# EAGLE schematic MCU (EAGLE 9.1.3)
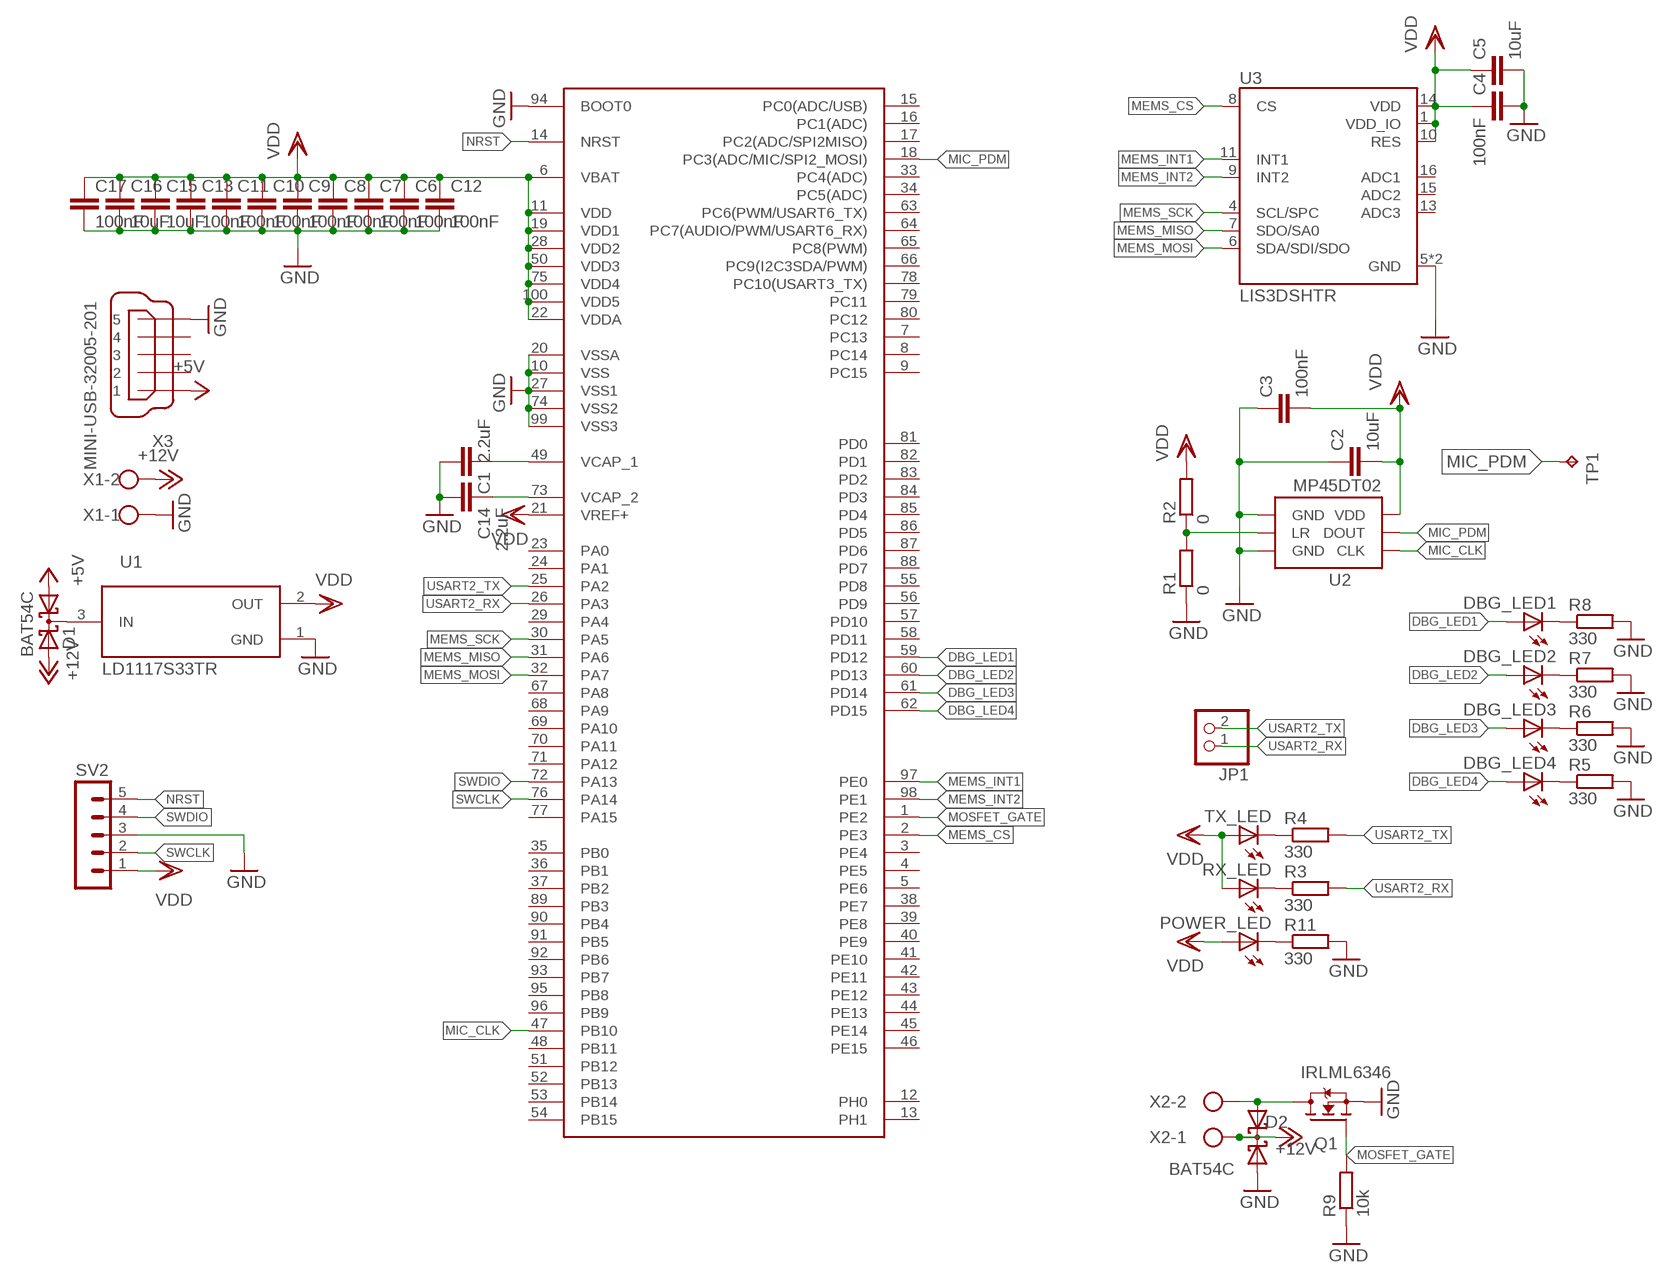
[diagram p0: schematic, sheet 1]

## Parts
C1  2.2uF  C-EUC0603  [C0603]
C2  10uF  C-EUC0805  [C0805]
C3  100nF  C-EUC0603  [C0603]
C4  100nF  C-EUC0603  [C0603]
C5  10uF  C-EUC0805  [C0805]
C6  100nF  C-EUC0603  [C0603]
C7  100nF  C-EUC0603  [C0603]
C8  100nF  C-EUC0603  [C0603]
C9  100nF  C-EUC0603  [C0603]
C10  100nF  C-EUC0603  [C0603]
C11  100nF  C-EUC0603  [C0603]
C12  100nF  C-EUC0603  [C0603]
C13  100nF  C-EUC0603  [C0603]
C14  2.2uF  C-EUC0603  [C0603]
C15  10uF  C-EUC0805  [C0805]
C16  10uF  C-EUC0805  [C0805]
C17  100nF  C-EUC0603  [C0603]
D1  BAT54C  [SOT23]
D2  BAT54C  [SOT23]
DBG_LED1  LEDCHIP-LED0603  [CHIP-LED0603]
DBG_LED2  LEDCHIP-LED0603  [CHIP-LED0603]
DBG_LED3  LEDCHIP-LED0603  [CHIP-LED0603]
DBG_LED4  LEDCHIP-LED0603  [CHIP-LED0603]
JP1  PINHD-1X2  [1X02]
POWER_LED  LEDCHIP-LED0603  [CHIP-LED0603]
Q1  IRLML6346  [SOT23]
R1  0  R-EU_R0603  [R0603]
R2  0  R-EU_R0603  [R0603]
R3  330  R-EU_R0603  [R0603]
R4  330  R-EU_R0603  [R0603]
R5  330  R-EU_R0603  [R0603]
R6  330  R-EU_R0603  [R0603]
R7  330  R-EU_R0603  [R0603]
R8  330  R-EU_R0603  [R0603]
R9  10k  R-EU_R0603  [R0603]
R11  330  R-EU_R0603  [R0603]
RX_LED  LEDCHIP-LED0603  [CHIP-LED0603]
SV2  MA05-1  [MA05-1]
TP1  TPB1,27  [B1,27]
TX_LED  LEDCHIP-LED0603  [CHIP-LED0603]
U1  LD1117S33TR  [SOT230P700X180-4N]
U2  MP45DT02  [ST_HLGA6]
U3  LIS3DSHTR  [LGA16R50P5X3_300X300X100N]
U$1  STM32F407STM32D40X  [LQFP100]
X1  W237-102  [W237-102]
X2  W237-102  [W237-102]
X3  MINI-USB-32005-201  [32005-201]

## Nets
+5V: D1.1(A1) X3.1
+12V: D1.2(A2) D2.3(CC) X1.2 X2.1
DBG_LED1: DBG_LED1.A U$1.59(PD12)
DBG_LED2: DBG_LED2.A U$1.60(PD13)
DBG_LED3: DBG_LED3.A U$1.61(PD14)
DBG_LED4: DBG_LED4.A U$1.62(PD15)
GND: C1.2 C2.1 C3.1 C4.2 C5.2 C6.2 C7.2 C8.2 C9.2 C10.2 C11.2 C12.2 C13.2 C14.2 C15.2 C16.2 C17.2 D2.1(A1) Q1.2(S) R1.1 R5.2 R6.2 R7.2 R8.2 R9.1 R11.2 SV2.3 U1.1(GND) U2.1(GND) U2.3(GND) U3.5(GND) U3.12(GND) U$1.10(VSS) U$1.20(VSSA) U$1.27(VSS1) U$1.74(VSS2) U$1.94(BOOT0) U$1.99(VSS3) X1.1 X3.5
MEMS_CS: U3.8(CS) U$1.2(PE3)
MEMS_INT1: U3.11(INT1) U$1.97(PE0)
MEMS_INT2: U3.9(INT2) U$1.98(PE1)
MEMS_MISO: U3.7(SDO/SA0) U$1.31(PA6)
MEMS_MOSI: U3.6(SDA/SDI/SDO) U$1.32(PA7)
MEMS_SCK: U3.4(SCL/SPC) U$1.30(PA5)
MIC_CLK: U2.4(CLK) U$1.47(PB10)
MIC_PDM: TP1.TP U2.5(DOUT) U$1.18(PC3(ADC/MIC/SPI2_MOSI))
MOSFET_GATE: Q1.1(G) R9.2 U$1.1(PE2)
N$1: POWER_LED.C R11.1
N$2: C14.1 U$1.73(VCAP_2)
N$3: R1.2 R2.1 U2.2(LR)
N$4: R3.1 RX_LED.C
N$5: C1.1 U$1.49(VCAP_1)
N$6: D1.3(CC) U1.3(IN)
N$7: R4.1 TX_LED.C
N$9: DBG_LED4.C R5.1
N$10: DBG_LED3.C R6.1
N$11: DBG_LED2.C R7.1
N$12: DBG_LED1.C R8.1
N$13: D2.2(A2) Q1.3(D) X2.2
NRST: SV2.5 U$1.14(NRST)
SWCLK: SV2.2 U$1.76(PA14)
SWDIO: SV2.4 U$1.72(PA13)
USART2_RX: JP1.1 R3.2 U$1.26(PA3)
USART2_TX: JP1.2 R4.2 U$1.25(PA2)
VDD: C2.2 C3.2 C4.1 C5.1 C6.1 C7.1 C8.1 C9.1 C10.1 C11.1 C12.1 C13.1 C15.1 C16.1 C17.1 POWER_LED.A R2.2 RX_LED.A SV2.1 TX_LED.A U1.2(OUT) U2.6(VDD) U3.1(VDD_IO) U3.10(RES) U3.14(VDD) U$1.6(VBAT) U$1.11(VDD) U$1.19(VDD1) U$1.21(VREF+) U$1.22(VDDA) U$1.28(VDD2) U$1.50(VDD3) U$1.75(VDD4) U$1.100(VDD5)
Unconnected: U3.13(ADC3) U3.15(ADC2) U3.16(ADC1) U$1.3(PE4) U$1.4(PE5) U$1.5(PE6) U$1.7(PC13) U$1.8(PC14) U$1.9(PC15) U$1.12(PH0) U$1.13(PH1) U$1.15(PC0(ADC/USB)) U$1.16(PC1(ADC)) U$1.17(PC2(ADC/SPI2MISO)) U$1.23(PA0) U$1.24(PA1) U$1.29(PA4) U$1.33(PC4(ADC)) U$1.34(PC5(ADC)) U$1.35(PB0) U$1.36(PB1) U$1.37(PB2) U$1.38(PE7) U$1.39(PE8) U$1.40(PE9) U$1.41(PE10) U$1.42(PE11) U$1.43(PE12) U$1.44(PE13) U$1.45(PE14) U$1.46(PE15) U$1.48(PB11) U$1.51(PB12) U$1.52(PB13) U$1.53(PB14) U$1.54(PB15) U$1.55(PD8) U$1.56(PD9) U$1.57(PD10) U$1.58(PD11) U$1.63(PC6(PWM/USART6_TX)) U$1.64(PC7(AUDIO/PWM/USART6_RX)) U$1.65(PC8(PWM)) U$1.66(PC9(I2C3SDA/PWM)) U$1.67(PA8) U$1.68(PA9) U$1.69(PA10) U$1.70(PA11) U$1.71(PA12) U$1.77(PA15) U$1.78(PC10(USART3_TX)) U$1.79(PC11) U$1.80(PC12) U$1.81(PD0) U$1.82(PD1) U$1.83(PD2) U$1.84(PD3) U$1.85(PD4) U$1.86(PD5) U$1.87(PD6) U$1.88(PD7) U$1.89(PB3) U$1.90(PB4) U$1.91(PB5) U$1.92(PB6) U$1.93(PB7) U$1.95(PB8) U$1.96(PB9) X3.2 X3.3 X3.4

## Library data of the parts
C1-C17 = resistor:C-EU: CAPACITOR, European symbol
D1 D2 = diode:BAT54C: Schottky Diodes Source: Fairchild .. BAT54.pdf
DBG_LED1-DBG_LED4 POWER_LED RX_LED TX_LED = led:LED: LED OSRAM: - CHIPLED LG R971, LG N971, LY N971, LG Q971, LY Q971, LO R971, LY R971 LH N974, LH R974 LS Q976, LO Q976, LY Q976 LO Q996 - Hyper CHIPLED LW Q18S LB Q993, LB Q99A, LB R99A - SideLED LS A670, LO A670, LY A670, LG A670, LP A670 LB A673, LV A673, LT A673, LW A673 LH A674 LY A675 LS A676, LA A676, LO A676, LY A676, LW A676 LS A679, LY A679, LG A679 - Hyper Micro SIDELED® LS Y876, LA Y876, LO Y876, LY Y876 LT Y87S - SmartLED LW L88C, LW L88S LB L89C, LB L89S, LG L890 LS L89K, LO L89K, LY L89K LS L896, LA L896, LO L896, LY L896 - TOPLED LS T670, LO T670, LY T670, LG T670, LP T670 LSG T670, LSP T670, LSY T670, LOP T670, LYG T670 LG T671, LOG T671, LSG T671 LB T673, LV T673, LT T673, LW T673 LH T674 LS T676, LA T676, LO T676, LY T676, LB T676, LH T676, LSB T676, LW T676 LB T67C, LV T67C, LT T67C, LS T67K, LO T67K, LY T67K, LW E67C LS E67B, LA E67B, LO E67B, LY E67B, LB E67C, LV E67C, LT E67C LW T67C LS T679, LY T679, LG T679 LS T770, LO T770, LY T770, LG T770, LP T770 LB T773, LV T773, LT T773, LW T773 LH T774 LS E675, LA E675, LY E675, LS T675 LS T776, LA T776, LO T776, LY T776, LB T776 LHGB T686 LT T68C, LB T68C - Hyper Mini TOPLED® LB M676 - Mini TOPLED Santana® LG M470 LS M47K, LO M47K, LY M47K Source: http://www.osram.convergy.de LUXEON: - LUMILED® LXK2-PW12-R00, LXK2-PW12-S00, LXK2-PW14-U00, LXK2-PW14-V00 LXK2-PM12-R00, LXK2-PM12-S00, LXK2-PM14-U00 LXK2-PE12-Q00, LXK2-PE12-R00, LXK2-PE12-S00, LXK2-PE14-T00, LXK2-PE14-U00 LXK2-PB12-K00, LXK2-PB12-L00, LXK2-PB12-M00, LXK2-PB14-N00, LXK2-PB14-P00, LXK2-PB14-Q00 LXK2-PR12-L00, LXK2-PR12-M00, LXK2-PR14-Q00, LXK2-PR14-R00 LXK2-PD12-Q00, LXK2-PD12-R00, LXK2-PD12-S00 LXK2-PH12-R00, LXK2-PH12-S00 LXK2-PL12-P00, LXK2-PL12-Q00, LXK2-PL12-R00 Source: www.luxeon.com KINGBRIGHT: KA-3528ASYC Source: www.kingbright.com
JP1 = pinhead:PINHD-1X2: PIN HEADER
Q1 = bss138_10:IRLML6346: BSS138 N-Channel Logic Level Enhancement Mode Field Effect Transistor Source: http://www.fairchildsemi.com/datasheets/BS/BSS138.pdf; MF: Fairchild; MPN: BSS138; OC_FARNELL: 9845330; OC_NEWARK: 67R2009
R1-R9 R11 = resistor:R-EU_: RESISTOR, European symbol
SV2 = con-lstb:MA05-1: PIN HEADER; OC_FARNELL: unknown; OC_NEWARK: unknown
TP1 = testpad:TP: Test pad
U1 = LD1117S33TR:LD1117S33TR: LDO Voltage Regulators 3.3V 0.8A Positive; AVAILABILITY: Unavailable; DESCRIPTION: LD1117 Series 1300 mA 3.3 V Fixed Output Positive Voltage LDO Regulator- SOT-223; MF: STMicroelectronics; MP: LD1117S33TR; PACKAGE: SOT-223 STMicroelectronics; PRICE: None
U2 = MP45DT02:MP45DT02: Digital MEMS microphone; AVAILABILITY: Unavailable; DESCRIPTION: Mic Omni-Directional -26dB 3.6V Rectangular Solder Pad; MF: STMicroelectronics; MP: MP45DT02; PACKAGE: PDIP-18 STMicroelectronics; PRICE: None
U3 = LIS3DSHTR:LIS3DSHTR: MEMS digital output motion sensor ultra low-power high performance 3-axes "nano" accelerometer; AVAILABILITY: Unavailable; DESCRIPTION: MEMS digital output motion sensor: ultra low-power high performance 3-axes nano accelerometer; MF: STMicroelectronics; MP: LIS3DSHTR; PACKAGE: LGA-16 STMicroelectronics; PRICE: None
U$1 = stm32f:STM32F407: Features • Core: ARM 32-bit Cortex™-M4 CPU with FPU, Adaptive real-time accelerator (ART Accelerator™) allowing 0-wait state execution from Flash memory, frequency up to 168 MHz, memory protection unit, 210 DMIPS/ 1.25 DMIPS/MHz (Dhrystone 2.1), and DSP instructions • Memories – Up to 1 Mbyte of Flash memory – Up to 192+4 Kbytes of SRAM including 64- Kbyte of CCM (core coupled memory) data RAM – Flexible static memory controller supporting Compact Flash, SRAM, PSRAM, NOR and NAND memories • LCD parallel interface, 8080/6800 modes • Clock, reset and supply management – 1.8 V to 3.6 V application supply and I/Os – POR, PDR, PVD and BOR – 4-to-26 MHz crystal oscillator – Internal 16 MHz factory-trimmed RC (1% accuracy) – 32 kHz oscillator for RTC with calibration – Internal 32 kHz RC with calibration • Low power – Sleep, Stop and Standby modes – VBAT supply for RTC, 20×32 bit backup registers + optional 4 KB backup SRAM • 3×12-bit, 2.4 MSPS A/D converters: up to 24 channels and 7.2 MSPS in triple interleaved mode • 2×12-bit D/A converters • General-purpose DMA: 16-stream DMA controller with FIFOs and burst support • Up to 17 timers: up to twelve 16-bit and two 32- bit timers up to 168 MHz, each with up to 4 IC/OC/PWM or pulse counter and quadrature (incremental) encoder input • Debug mode – Serial wire debug (SWD) & JTAG interfaces – Cortex-M4 Embedded Trace Macrocell™ • Up to 140 I/O ports with interrupt capability – Up to 136 fast I/Os up to 84 MHz – Up to 138 5 V-tolerant I/Os • Up to 15 communication interfaces – Up to 3 × I2C interfaces (SMBus/PMBus) – Up to 4 USARTs/2 UARTs (10.5 Mbit/s, ISO 7816 interface, LIN, IrDA, modem control) – Up to 3 SPIs (42 Mbits/s), 2 with muxed full-duplex I2S to achieve audio class accuracy via internal audio PLL or external clock – 2 × CAN interfaces (2.0B Active) – SDIO interface • Advanced connectivity – USB 2.0 full-speed device/host/OTG controller with on-chip PHY – USB 2.0 high-speed/full-speed device/host/OTG controller with dedicated DMA, on-chip full-speed PHY and ULPI – 10/100 Ethernet MAC with dedicated DMA: supports IEEE 1588v2 hardware, MII/RMII • 8- to 14-bit parallel camera interface up to 54 Mbytes/s • True random number generator • CRC calculation unit • 96-bit unique ID • RTC: subsecond accuracy, hardware calendar
X1 X2 = con-wago-500:W237-102: WAGO SCREW CLAMP; MPN: 237-102; OC_FARNELL: unknown; OC_NEWARK: 70K9898
X3 = con-cypressindustries:MINI-USB-: MINI USB-B Conector Source: www.cypressindustries.com; OC_FARNELL: unknown; OC_NEWARK: unknown